# Altium schematic sheet miniPCIe_EC200U.SchDoc
size A3; SheetNumber: 8; SheetTotal: 10
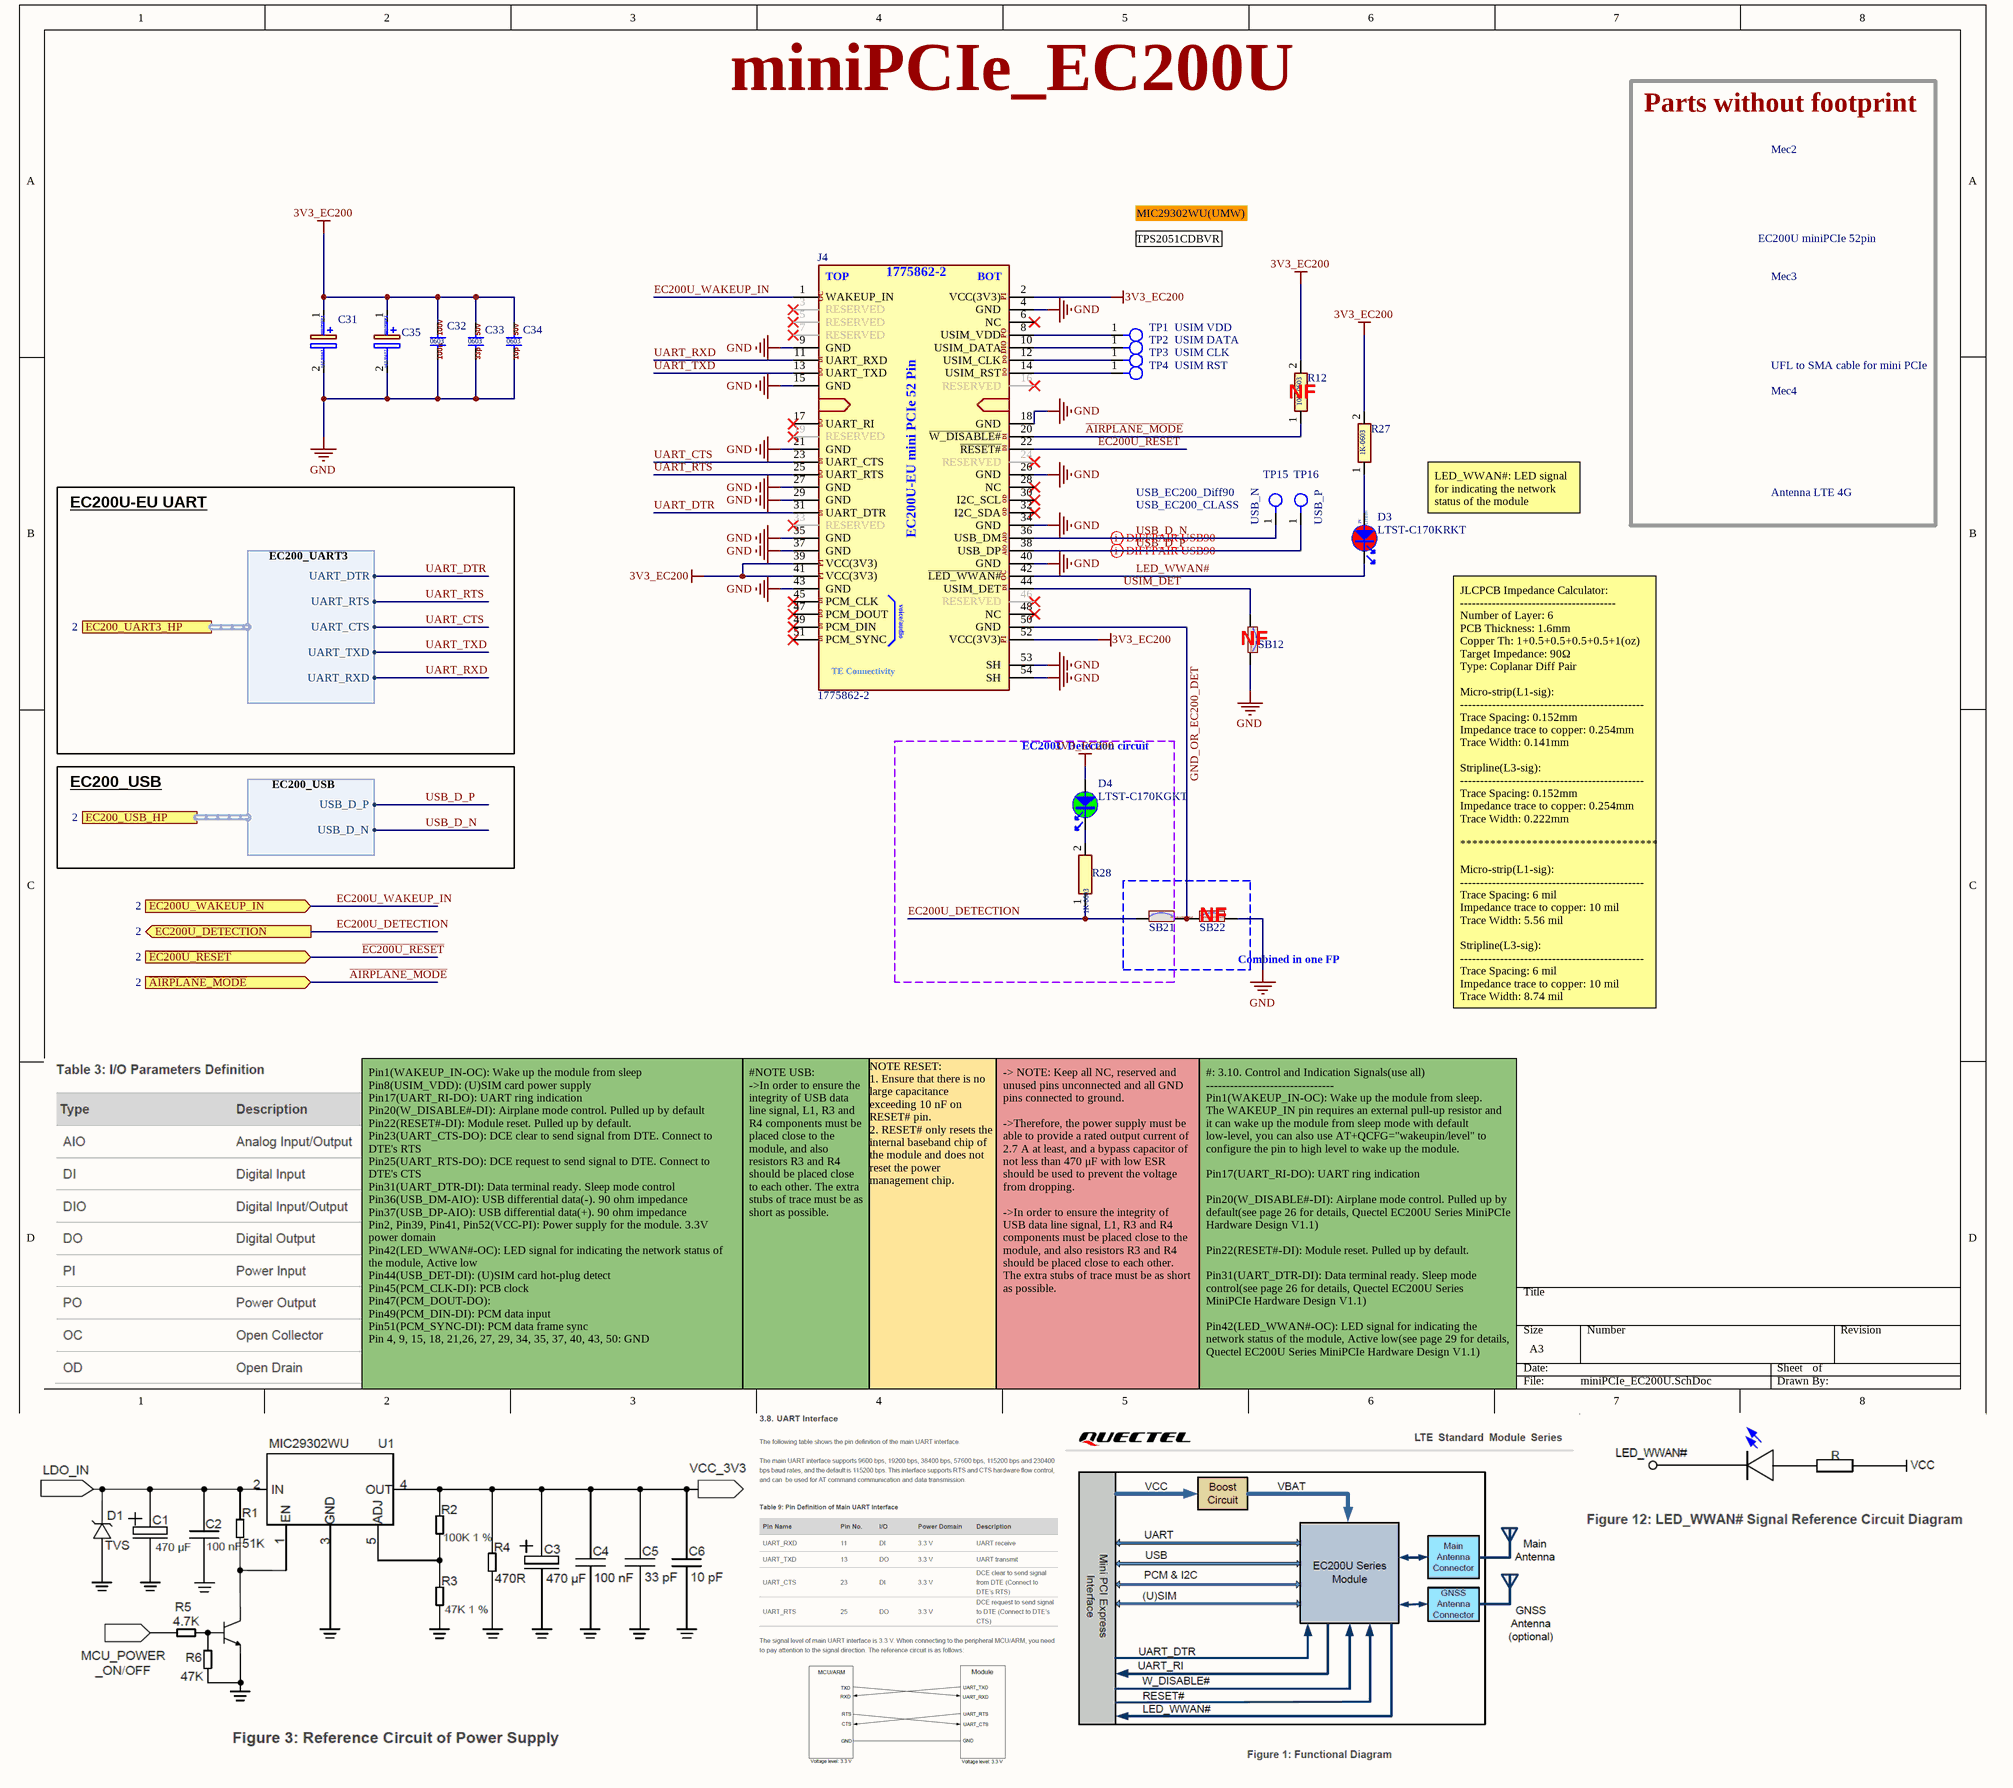
[diagram p0: miniPCIe_EC200U.SchDoc]

## Parts
C31  TAJC107K010RNJ  [CASE-C-6032]  (value not drawn)
C32  CL10B104KC8NNNC  [0603-CAP]  (value not drawn)
C33  CL10C330JB8NNNC  [0603-CAP]  (value not drawn)
C34  CL10C100JB8NNNC  [0603-CAP]  (value not drawn)
C35  TAJD227K010RNJ  [CASE-D-7343]  (value not drawn)
D3  LTST-C170KRKT  [0805-LED-RED]
D4  LTST-C170KGKT  [0805-LED-BLUE]
J4  1775862-2  [mini PCIe 52p 67910-5700]
Mec2  EC200U miniPCIe 52pin  [mini PCIe 52pin Module]  (mechanical)
Mec3  UFL to SMA cable for mini PCIe  (mechanical)
Mec4  Antenna LTE 4G  (mechanical)
R12  0603WAF1002T5E  [0603-RES]  (value not drawn)
R27  0603WAF1001T5E  [0603-RES]  (value not drawn)
R28  0603WAF1001T5E  [0603-RES]  (value not drawn)
SB12  0603WAF0000T5E  [SOLDER-BRIDGE_R0603-0R]  (value not drawn)
SB21  0603WAF0000T5E  [SOLDER-BRIDGE_R0603-0R]  (value not drawn)
SB22  0603WAF0000T5E  [SOLDER-BRIDGE_R0603-0R]  (value not drawn)
TP1  USIM VDD  [Test Pad FP]
TP2  USIM DATA  [Test Pad FP]
TP3  USIM CLK  [Test Pad FP]
TP4  USIM RST  [Test Pad FP]
TP15  USB_N  [Test Pad FP]
TP16  USB_P  [Test Pad FP]

## Blocks framed on the sheet
Parts without footprint: Mec2-Mec4
EC200U Detection circuit: D4 R28
NF: SB21 SB22

## Ports
EC200_UART3_HP (harness EC200_UART3, see 2), EC200_USB_HP (harness EC200_USB, see 2), EC200U_DETECTION (out, see 2), EC200U_WAKEUP_IN (in, see 2), ~{AIRPLANE_MODE} (in, see 2), ~{EC200U_RESET} (in, see 2)

## Harnesses
EC200_UART3: UART_DTR, UART_RTS, UART_CTS, UART_TXD, UART_RXD
EC200_USB: USB_D_P, USB_D_N

## Nets
3V3_EC200: C31.1(+) C32.2 C33.2 C34.2 C35.1(+) D4.1 J4.2(VCC(3V3)) J4.39(VCC(3V3)) J4.41(VCC(3V3)) J4.52(VCC(3V3)) R12.2 R27.2
GND: C31.2(-) C32.1 C33.1 C34.1 C35.2(-) J4.4(GND) J4.9(GND) J4.15(GND) J4.18(GND) J4.21(GND) J4.26(GND) J4.27(GND) J4.29(GND) J4.34(GND) J4.35(GND) J4.37(GND) J4.40(GND) J4.43(GND) J4.53(SH) J4.54(SH) SB12.2 SB22.2
~{AIRPLANE_MODE}: J4.20(~{W_DISABLE#}) R12.1 ; port ~{AIRPLANE_MODE}
~{EC200U_RESET}: J4.22(~{RESET#}) ; port ~{EC200U_RESET}
EC200U_DETECTION: R28.1 SB21.2 ; port EC200U_DETECTION
EC200U_WAKEUP_IN: J4.1(WAKEUP_IN) ; port EC200U_WAKEUP_IN
GND_OR_EC200_DET: J4.50(GND) SB21.1 SB22.1
LED_WWAN#: D3.2 J4.42(~{LED_WWAN#})
UART_CTS: J4.23(UART_CTS) ; port EC200_UART3_HP.UART_CTS
UART_DTR: J4.31(UART_DTR) ; port EC200_UART3_HP.UART_DTR
UART_RTS: J4.25(UART_RTS) ; port EC200_UART3_HP.UART_RTS
UART_RXD: J4.11(UART_RXD) ; port EC200_UART3_HP.UART_RXD
UART_TXD: J4.13(UART_TXD) ; port EC200_UART3_HP.UART_TXD
USB_D_N: J4.36(USB_DM) TP15.1 ; port EC200_USB_HP.USB_D_N
USB_D_P: J4.38(USB_DP) TP16.1 ; port EC200_USB_HP.USB_D_P
USIM_DET: J4.44(USIM_DET) SB12.1
NetD3_1: D3.1 R27.1
NetD4_2: D4.2 R28.2
NetJ4_8: J4.8(USIM_VDD) TP1.1
NetJ4_10: J4.10(USIM_DATA) TP2.1
NetJ4_12: J4.12(USIM_CLK) TP3.1
NetJ4_14: J4.14(USIM_RST) TP4.1

Not connected (* = marked no-connect by the designer): J4 3(RESERVED)* 5(RESERVED)* 6(NC)* 7(RESERVED)* 16(RESERVED)* 17(UART_RI)* 19(RESERVED)* 24(RESERVED)* 28(NC)* 30(I2C_SCL)* 32(I2C_SDA)* 33(RESERVED)* 45(PCM_CLK)* 46(RESERVED)* 47(PCM_DOUT)* 48(NC)* 49(PCM_DIN)* 51(PCM_SYNC)*

## Layout directives
differential pair; differential pair class USB_EC200_Diff90; net class USB_EC200_CLASS: USB_D_N, USB_D_P

## Notes on the sheet
- miniPCIe_EC200U
- MIC29302WU(UMW)
- TPS2051CDBVR
- (near R12) NF
- EC200U-EU UART
- LED_WWAN#: LED signal for indicating the network status of the module
- (near SB12) NF
- EC200_USB
- Combined in one FP
- JLCPCB Impedance Calculator:
  ---------------------------------------
  Number of Layer: 6
  PCB Thickness: 1.6mm
  Copper Th: 1+0.5+0.5+0.5+0.5+1(oz)
  Target Impedance: 90Ω
  Type: Coplanar Diff Pair
  Micro-strip(L1-sig):
  ----------------------------------------------
  Trace Spacing: 0.152mm
  Impedance trace to copper: 0.254mm
  Trace Width: 0.141mm
  Stripline(L3-sig):
  ----------------------------------------------
  Trace Spacing: 0.152mm
  Impedance trace to copper: 0.254mm
  Trace Width: 0.222mm
  *********************************
  Micro-strip(L1-sig):
  ----------------------------------------------
  Trace Spacing: 6 mil
  Impedance trace to copper: 10 mil
  Trace Width: 5.56 mil
  Stripline(L3-sig):
  ----------------------------------------------
  Trace Spacing: 6 mil
  Impedance trace to copper: 10 mil
  Trace Width: 8.74 mil
- Pin1(WAKEUP_IN-OC): Wake up the module from sleep
  Pin8(USIM_VDD): (U)SIM card power supply
  Pin17(UART_RI-DO): UART ring indication
  Pin20(W_DISABLE#-DI): Airplane mode control. Pulled up by default
  Pin22(RESET#-DI): Module reset. Pulled up by default.
  Pin23(UART_CTS-DO): DCE clear to send signal from DTE. Connect to DTE's RTS
  Pin25(UART_RTS-DO): DCE request to send signal to DTE. Connect to DTE's CTS
  Pin31(UART_DTR-DI): Data terminal ready. Sleep mode control
  Pin36(USB_DM-AIO): USB differential data(-). 90 ohm impedance
  Pin37(USB_DP-AIO): USB differential data(+). 90 ohm impedance
  Pin2, Pin39, Pin41, Pin52(VCC-PI): Power supply for the module. 3.3V power domain
  Pin42(LED_WWAN#-OC): LED signal for indicating the network status of the module, Active low
  Pin44(USB_DET-DI): (U)SIM card hot-plug detect
  Pin45(PCM_CLK-DI): PCB clock
  Pin47(PCM_DOUT-DO):
  Pin49(PCM_DIN-DI): PCM data input
  Pin51(PCM_SYNC-DI): PCM data frame sync
  Pin 4, 9, 15, 18, 21,26, 27, 29, 34, 35, 37, 40, 43, 50: GND
- #NOTE USB:
  ->In order to ensure the integrity of USB data line signal, L1, R3 and R4 components must be placed close to the module, and also resistors R3 and R4 should be placed close to each other. The extra stubs of trace must be as short as possible.
- NOTE RESET:
  1. Ensure that there is no large capacitance exceeding 10 nF on RESET# pin.
  2. RESET# only resets the internal baseband chip of the module and does not reset the power
  management chip.
- -> NOTE: Keep all NC, reserved and unused pins unconnected and all GND pins connected to ground.
  ->Therefore, the power supply must be able to provide a rated output current of 2.7 A at least, and a bypass capacitor of not less than 470 μF with low ESR should be used to prevent the voltage from dropping.
  ->In order to ensure the integrity of USB data line signal, L1, R3 and R4 components must be placed close to the module, and also resistors R3 and R4 should be placed close to each other. The extra stubs of trace must be as short as possible.
- #: 3.10. Control and Indication Signals(use all)
  --------------------------------
  Pin1(WAKEUP_IN-OC): Wake up the module from sleep.
  The WAKEUP_IN pin requires an external pull-up resistor and it can wake up the module from sleep mode with default low-level, you can also use AT+QCFG="wakeupin/level" to configure the pin to high level to wake up the module.
  Pin17(UART_RI-DO): UART ring indication
  Pin20(W_DISABLE#-DI): Airplane mode control. Pulled up by default(see page 26 for details, Quectel EC200U Series MiniPCIe Hardware Design V1.1)
  Pin22(RESET#-DI): Module reset. Pulled up by default.
  Pin31(UART_DTR-DI): Data terminal ready. Sleep mode control(see page 26 for details, Quectel EC200U Series MiniPCIe Hardware Design V1.1)
  Pin42(LED_WWAN#-OC): LED signal for indicating the network status of the module, Active low(see page 29 for details, Quectel EC200U Series MiniPCIe Hardware Design V1.1)
- (in symbol 0603WAF1001T5E) 1K-0603
- (in symbol 0603WAF1002T5E) 10K-0603
- (in symbol 1775862-2) TOP; BOT; OC; PI; PO; DIO; DI; DO; OD; EC200U-EU mini PCIe 52 Pin; AIO; voice/audio; TE Connectivity
- (in symbol CL10B104KC8NNNC) 100v; 0603; 100n
- (in symbol CL10C100JB8NNNC) 50v; 0603; 10p
- (in symbol CL10C330JB8NNNC) 50v; 0603; 33p
- (in symbol LTST-C170KGKT) LITEON; 2V
- (in symbol LTST-C170KRKT) 2V; LITEON
- (in symbol TAJC107K010RNJ) Tantalum; 100u/10v
- (in symbol TAJD227K010RNJ) Tantalum; 220u/10v

## Library data of the parts
C31 = TAJC107K010RNJ: CAP: TANT 100uF ±10% 10V CASE-C-6032; POC Price: 0.2633; LCSC Part #: C8649; Unit Price: 0.1376; ComponentLink1Description: DS; ComponentLink1URL: http://datasheets.avx.com/TAJ.pdf
C32 = CL10B104KC8NNNC: CAP: CER 100NF 100V X7R 0603; POC Price: 0.006; LCSC Part #: C15725; Unit Price: 0.0036; ComponentLink1Description: DS; ComponentLink1URL: https://www.lcsc.com/datasheet/C15725.pdf
C33 = CL10C330JB8NNNC: CAP: CER 33PF 50V C0G 0603; LCSC Part #: C1663; Unit Price: 0.0031; ComponentLink1Description: DS; ComponentLink1URL: https://www.lcsc.com/datasheet/C1663.pdf
C34 = CL10C100JB8NNNC: CAP: CER 10PF 50V C0G 0603; LCSC Part #: C1634; Unit Price: 0.0028; ComponentLink1Description: DS; ComponentLink1URL: https://www.lcsc.com/datasheet/C1634.pdf
C35 = TAJD227K010RNJ: CAP: TANT 220uF ±10% 10V CASE-D-7343; POC Price: 0.3941; LCSC Part #: C8024; Unit Price: 0.2118
D3 = LTST-C170KRKT: LED: RED 20mA 54mcd Colorless Transparent Lens -55℃~+85℃ 631nm Red 130° 75mW 2V 0805 LED; POC Price: 0.0229; LCSC Part #: C94868; Unit Price: 0.0107
D4 = LTST-C170KGKT: LED: GREEN 20mA 35mcd Water Clear -55℃~+85℃ 571nm Yellow Green 130° 75mW 2V 0805 LED Indication - Discrete ROHS; POC Price: 0.0216; LCSC Part #: C98221; Unit Price: 0.0095; ComponentLink1Description: DS; ComponentLink1URL: https://www.lcsc.com/datasheet/C98221.pdf
J4 = 1775862-2: MODULE Connector: Mini PCIe 52-pin Connector SMD,P=0.8mm, Surface Mount,Right Angle PCI / PCIe Connector ROHS; POC Price: 0.7298; LCSC Part #: C428486; ComponentLink1Description: DS; ComponentLink1URL: https://www.molex.com/content/dam/molex/molex-dot-com/products/automated/en-us/salesdrawingpdf/679/67910/679105700_sd.pdf?inline; Unit Price: 0.3649
Mec2 = EC200U miniPCIe 52pin: MODULE: Quectel EC200U miniPCIe 52pin 4G LTE GSM, PCIe,; POC Price: 15; LCSC Part #: https://www.alibaba.com/product-detail/Brand-New-and-Original-Quectel-EC200U_1601064789596.html?spm=a2700.prosearch.normal_offer.d_title.422b67afllIdzs&priceId=50a60fb9066940529a1ec6d8fa9d6de6; Unit Price: 10; ComponentLink1Description: DS; ComponentLink1URL: https://www.quectel.com/download/quectel_ec200u_series_mini_pcie_hardware_design_v1-1/
Mec3 = UFL to SMA: Antenna: UFL to SMA cable for mini PCIe; POC Price: 1; ComponentLink1Description: DS; ComponentLink1URL: https://www.robotechbd.com/product/wireless-communication/wi-fi/ipx-antenna-adapter-wire-for-wifi-gsm-gps-1-13mm/?srsltid=AfmBOorCMt7rqkyjPz3-0c_fwJbcSa-rEp0Q6wX8ybJDhvlJA9ge8PRj; LCSC Part #: https://www.robotechbd.com/product/wireless-communication/wi-fi/ipx-antenna-adapter-wire-for-wifi-gsm-gps-1-13mm/?srsltid=AfmBOorCMt7rqkyjPz3-0c_fwJbcSa-rEp0Q6wX8ybJDhvlJA9ge8PRj; Unit Price: 0.4; ComponentLink2Description: Purchase; ComponentLink2URL: https://www.robotechbd.com/product/wireless-communication/wi-fi/ipx-antenna-adapter-wire-for-wifi-gsm-gps-1-13mm/?srsltid=AfmBOorCMt7rqkyjPz3-0c_fwJbcSa-rEp0Q6wX8ybJDhvlJA9ge8PRj
Mec4 = Antenna LTE 4G: Antenna: LTE 4G 4G LTE Sucker Antenna Full Netcom High Gain Communication Antenna IoT Router Terminal Sucker Antenna; POC Price: 0.4; ComponentLink1Description: Purchase Link; ComponentLink1URL: *
R12 = 0603WAF1002T5E: RES: 10K OHM 1% 100mW 0603 75V; LCSC Part #: C25804; Unit Price: 0.0005; ComponentLink1Description: DS; ComponentLink1URL: https://www.lcsc.com/datasheet/C25804.pdf
R27 R28 = 0603WAF1001T5E: RES: 1K OHM 1% 100mW 0603 75V; LCSC Part #: C21190; Unit Price: 0.0005; ComponentLink1Description: DS; ComponentLink1URL: https://www.lcsc.com/datasheet/C21190.pdf
SB12 SB21 SB22 = 0603WAF0000T5E: Solder Bridge: ON SB 0603; LCSC Part #: C21189; Unit Price: 0.0006; ComponentLink1Description: DS; ComponentLink1URL: https://www.lcsc.com/datasheet/C21189.pdf
TP1-TP4 TP15 TP16 = Test Pad: TESTPAD: Test Pad